# Altium schematic sheet lm334sm.SchDoc
size A4; SheetNumber: 4; SheetTotal: 9
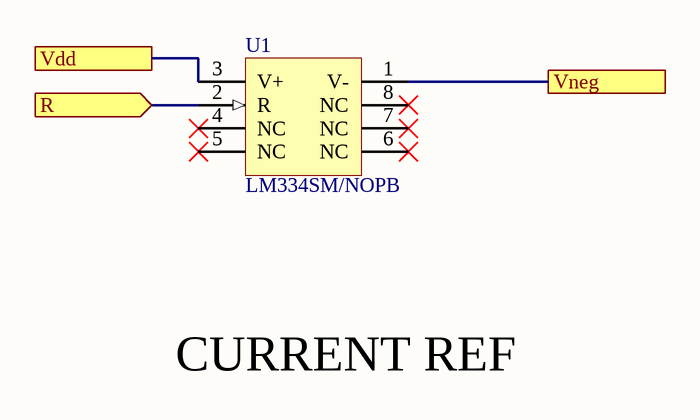
[diagram p0: lm334sm.SchDoc]

## Parts
U1  LM334SM/NOPB  [D0008A_M]

## Ports
R (in, see THE_FIRST[6E]), Vdd (see THE_FIRST[6F], DP10[1B], DP[2B], ldo1.1[1B], LDO3.3[1B], ldo[1B]), Vneg (see THE_FIRST[6E])

## Nets
R: U1.2(R) ; port R
Vdd: U1.3(V+) ; port Vdd
Vneg: U1.1(V-) ; port Vneg

Not connected (* = marked no-connect by the designer): U1 4(NC)* 5(NC)* 6(NC)* 7(NC)* 8(NC)*

## Notes on the sheet
- CURRENT REF

## Library data of the parts
U1 = CMP-0063-00597-4: 3-Terminal Adjustable Current Source, 8-pin Narrow SOIC, Pb-Free; Manufacturer: Texas Instruments; High-Reliability: Y; PowerWise: N; PackageTopMarking: NSZXTT*LM334*SM; CompType: MiscPower; ComponentLink1Description: Datasheet URL; PinCount: 8; PackageDescription: SOIC Narrow, 4.9 x 3.9 x 1.45mm, 8 Lead, 1.27mm Pitch; Code_JEDEC: MS-012-AA; Code_IPC: SOIC127P600-8; RoHS: Y; PackageReference: D0008A; ComponentLink1URL: http://www.ti.com/general/docs/lit/getliterature.tsp?genericPartNumber=LM334&fileType=pdf; PartNumber: LM334SM/NOPB